# EAGLE design R601E (EAGLE 6.6.0)
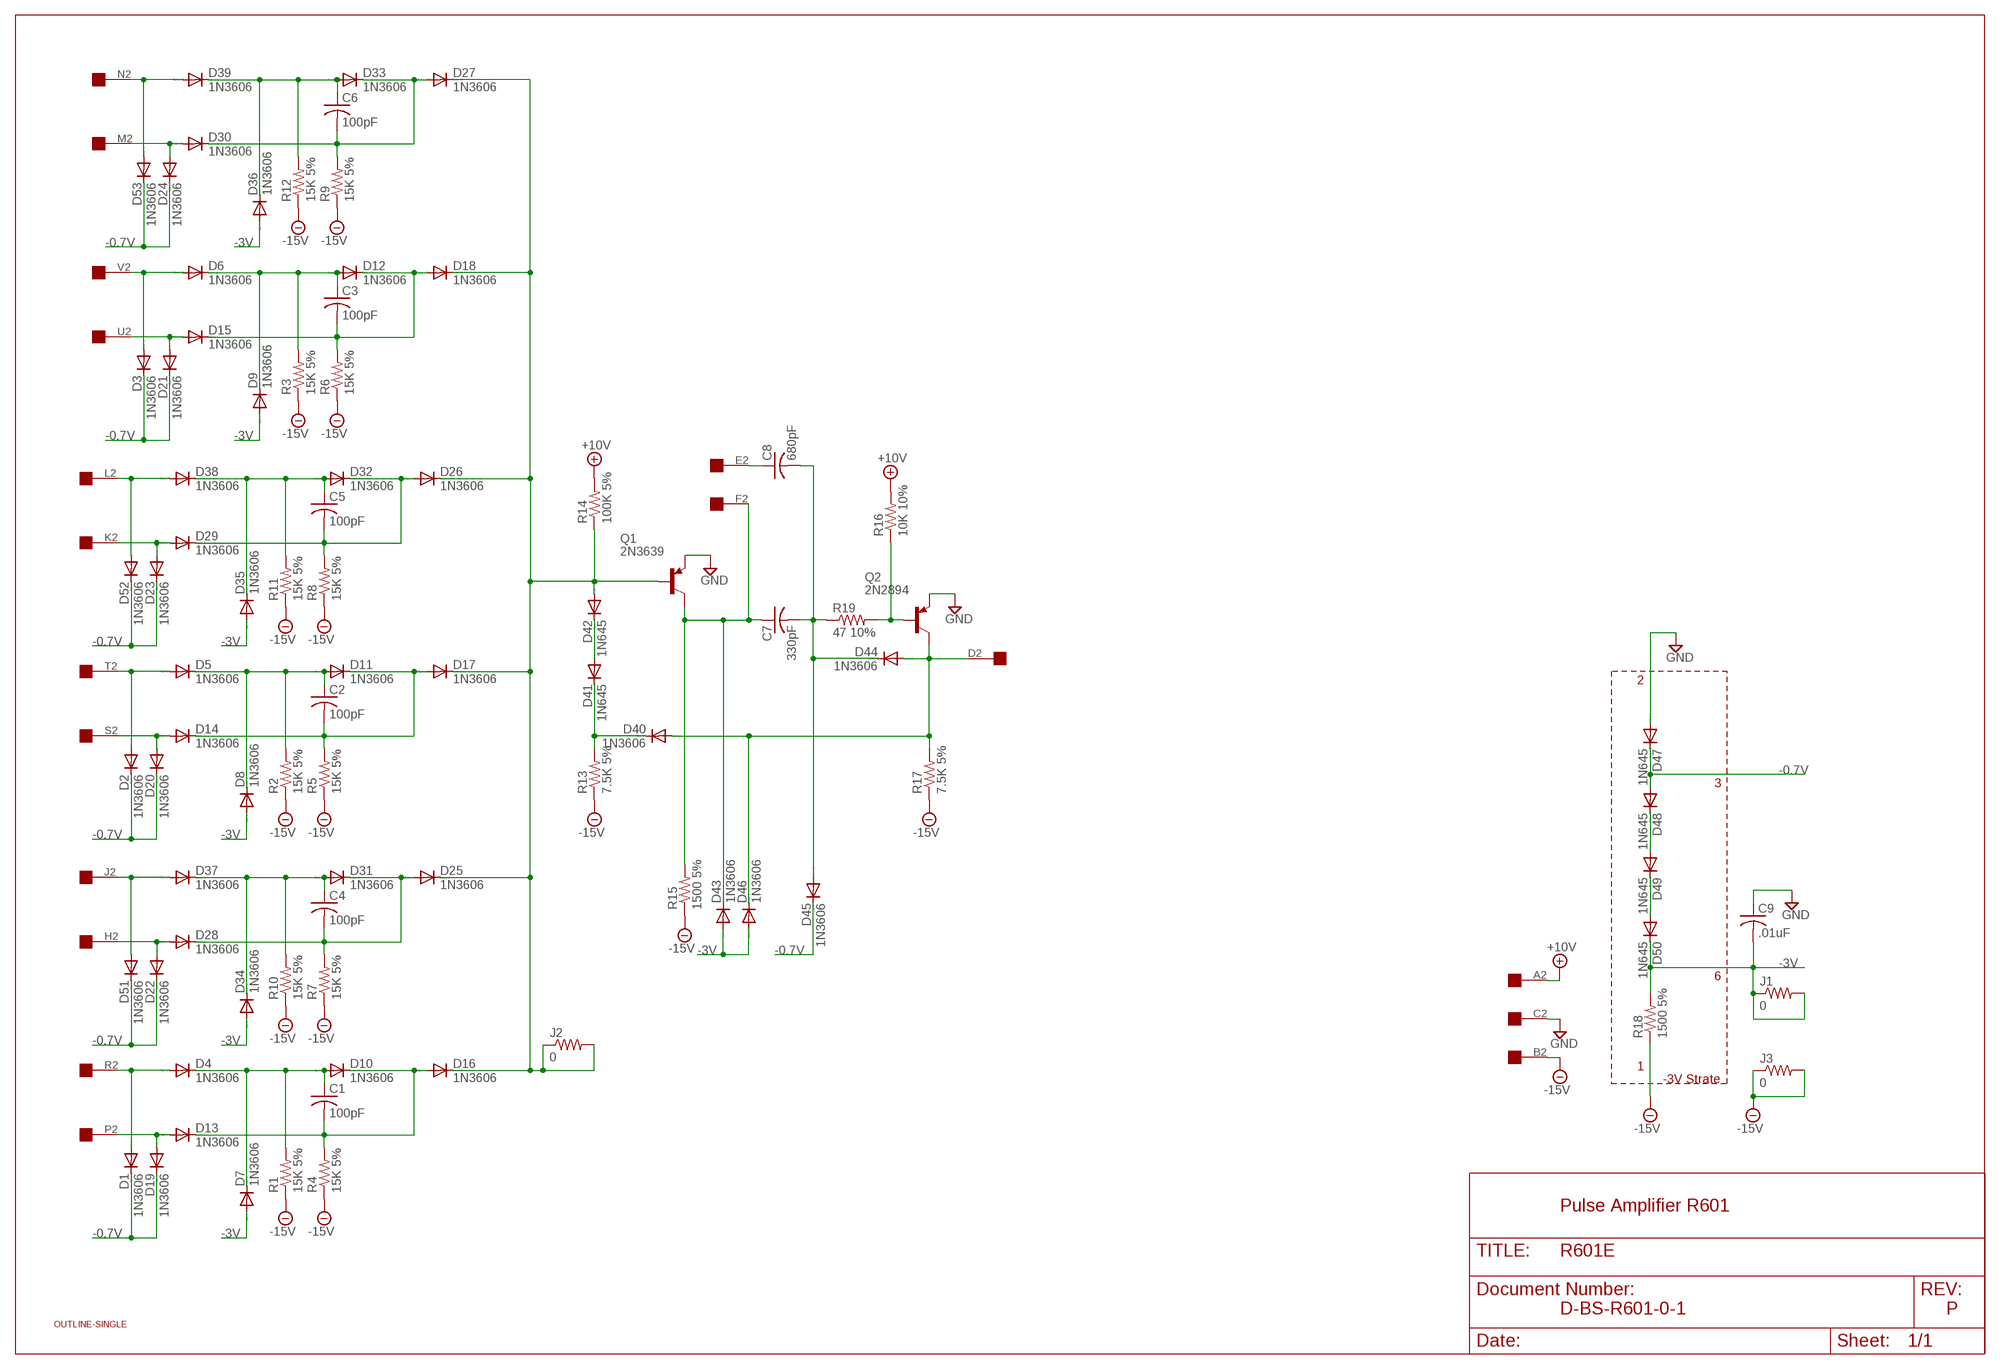
[diagram p0: schematic, sheet 1]

## Parts
C1  100pF  C-US  [C063-025X075]
C2  100pF  C-US  [C063-025X075]
C3  100pF  C-US  [C063-025X075]
C4  100pF  C-US  [C063-025X075]
C5  100pF  C-US  [C063-025X075]
C6  100pF  C-US  [C063-025X075]
C7  330pF  C-US  [C063-025X075]
C8  680pF  C-US  [C063-025X075]
C9  .01uF  C-US  [C063-025X075]
D1  1N3606  1N4148DO35-10  [DO35-10]
D2  1N3606  1N4148DO35-10  [DO35-10]
D3  1N3606  1N4148DO35-10  [DO35-10]
D4  1N3606  1N4148DO35-10  [DO35-10]
D5  1N3606  1N4148DO35-10  [DO35-10]
D6  1N3606  1N4148DO35-10  [DO35-10]
D7  1N3606  1N4148DO35-10  [DO35-10]
D8  1N3606  1N4148DO35-10  [DO35-10]
D9  1N3606  1N4148DO35-10  [DO35-10]
D10  1N3606  1N4148DO35-10  [DO35-10]
D11  1N3606  1N4148DO35-10  [DO35-10]
D12  1N3606  1N4148DO35-10  [DO35-10]
D13  1N3606  1N4148DO35-10  [DO35-10]
D14  1N3606  1N4148DO35-10  [DO35-10]
D15  1N3606  1N4148DO35-10  [DO35-10]
D16  1N3606  1N4148DO35-10  [DO35-10]
D17  1N3606  1N4148DO35-10  [DO35-10]
D18  1N3606  1N4148DO35-10  [DO35-10]
D19  1N3606  1N4148DO35-10  [DO35-10]
D20  1N3606  1N4148DO35-10  [DO35-10]
D21  1N3606  1N4148DO35-10  [DO35-10]
D22  1N3606  1N4148DO35-10  [DO35-10]
D23  1N3606  1N4148DO35-10  [DO35-10]
D24  1N3606  1N4148DO35-10  [DO35-10]
D25  1N3606  1N4148DO35-10  [DO35-10]
D26  1N3606  1N4148DO35-10  [DO35-10]
D27  1N3606  1N4148DO35-10  [DO35-10]
D28  1N3606  1N4148DO35-10  [DO35-10]
D29  1N3606  1N4148DO35-10  [DO35-10]
D30  1N3606  1N4148DO35-10  [DO35-10]
D31  1N3606  1N4148DO35-10  [DO35-10]
D32  1N3606  1N4148DO35-10  [DO35-10]
D33  1N3606  1N4148DO35-10  [DO35-10]
D34  1N3606  1N4148DO35-10  [DO35-10]
D35  1N3606  1N4148DO35-10  [DO35-10]
D36  1N3606  1N4148DO35-10  [DO35-10]
D37  1N3606  1N4148DO35-10  [DO35-10]
D38  1N3606  1N4148DO35-10  [DO35-10]
D39  1N3606  1N4148DO35-10  [DO35-10]
D40  1N3606  1N4148DO35-10  [DO35-10]
D41  1N645  1N4148DO35-10  [DO35-10]
D42  1N645  1N4148DO35-10  [DO35-10]
D43  1N3606  1N4148DO35-10  [DO35-10]
D44  1N3606  1N4148DO35-10  [DO35-10]
D45  1N3606  1N4148DO35-10  [DO35-10]
D46  1N3606  1N4148DO35-10  [DO35-10]
D47  1N645  1N4148DO35-10  [DO35-10]
D48  1N645  1N4148DO35-10  [DO35-10]
D49  1N645  1N4148DO35-10  [DO35-10]
D50  1N645  1N4148DO35-10  [DO35-10]
D51  1N3606  1N4148DO35-10  [DO35-10]
D52  1N3606  1N4148DO35-10  [DO35-10]
D53  1N3606  1N4148DO35-10  [DO35-10]
J1  0  R-US_0207/10  [0207/10]
J2  0  R-US_0207/10  [0207/10]
J3  0  R-US_0207/10  [0207/10]
Q1  2N3639  2N2904  [TO39]
Q2  2N2894  2N2904  [TO39]
R1  15K 5%  R-US_0207/10  [0207/10]
R2  15K 5%  R-US_0207/10  [0207/10]
R3  15K 5%  R-US_0207/10  [0207/10]
R4  15K 5%  R-US_0207/10  [0207/10]
R5  15K 5%  R-US_0207/10  [0207/10]
R6  15K 5%  R-US_0207/10  [0207/10]
R7  15K 5%  R-US_0207/10  [0207/10]
R8  15K 5%  R-US_0207/10  [0207/10]
R9  15K 5%  R-US_0207/10  [0207/10]
R10  15K 5%  R-US_0207/10  [0207/10]
R11  15K 5%  R-US_0207/10  [0207/10]
R12  15K 5%  R-US_0207/10  [0207/10]
R13  7.5K 5%  R-US_0207/10  [0207/10]
R14  100K 5%  R-US_0207/10  [0207/10]
R15  1500 5%  R-US_0207/10  [0207/10]
R16  10K 10%  R-US_0207/10  [0207/10]
R17  7.5K 5%  R-US_0207/10  [0207/10]
R18  1500 5%  R-US_0207/10  [0207/10]
R19  47 10%  R-US_0207/10  [0207/10]
U$1  OUTLINE-SINGLE  [SINGLE]
U$2  EDGE-1  [EDGE-CON1]

## Nets
+10V [Supply]: R14.2 R16.2 U$2.A2
-0.7V [Supply]: D1.C D2.C D3.C D19.C D20.C D21.C D22.C D23.C D24.C D45.C D47.C D48.A D51.C D52.C D53.C
-3V [Supply]: C9.2 D7.A D8.A D9.A D34.A D35.A D36.A D43.A D46.A D50.C J1.1 J1.2 R18.2
-15V [Supply]: J3.1 J3.2 R1.1 R2.1 R3.1 R4.1 R5.1 R6.1 R7.1 R8.1 R9.1 R10.1 R11.1 R12.1 R13.1 R15.1 R17.1 R18.1 U$2.B2
GND [Supply]: C9.1 D47.A Q1.1(E) Q2.1(E) U$2.C2
N$1: D37.A D51.A U$2.J2
N$2: D40.C D41.C R13.2
N$3: D39.A D53.A U$2.N2
N$4: D24.A D30.A U$2.M2
N$5: C6.1 D33.A D36.C D39.C R12.2
N$6: C6.2 D27.A D30.C D33.C R9.2
N$7: D41.A D42.C
N$8 [Supply]: D48.C D49.A
N$9 [Supply]: D49.C D50.A
N$10: D16.C D17.C D18.C D25.C D26.C D27.C D42.A J2.1 J2.2 Q1.2(B) R14.1
N$11: C7.1 D43.C Q1.3(C) R15.2 U$2.F2
N$12: C7.2 C8.2 D44.C D45.A R19.1
N$13: Q2.2(B) R16.1 R19.2
N$14: D40.A D44.A D46.C Q2.3(C) R17.2 U$2.D2
N$15: D3.A D6.A U$2.V2
N$16: D15.A D21.A U$2.U2
N$17: C3.1 D6.C D9.C D12.A R3.2
N$18: C3.2 D12.C D15.C D18.A R6.2
N$19: D38.A D52.A U$2.L2
N$20: D23.A D29.A U$2.K2
N$21: C5.1 D32.A D35.C D38.C R11.2
N$22: C5.2 D26.A D29.C D32.C R8.2
N$23: D22.A D28.A U$2.H2
N$24: C4.1 D31.A D34.C D37.C R10.2
N$25: C4.2 D25.A D28.C D31.C R7.2
N$26: D1.A D4.A U$2.R2
N$27: D13.A D19.A U$2.P2
N$28: C1.1 D4.C D7.C D10.A R1.2
N$29: C1.2 D10.C D13.C D16.A R4.2
N$30: C8.1 U$2.E2
N$31: D2.A D5.A U$2.T2
N$32: D14.A D20.A U$2.S2
N$33: C2.1 D5.C D8.C D11.A R2.2
N$34: C2.2 D11.C D14.C D17.A R5.2

## Notes on the sheet
- 2
- 3
- 6
- 1
- -3V Strate
- Pulse Amplifier R601
- D-BS-R601-0-1 | P

## Library data of the parts
C1-C9 = dec-con:C-US: Capacitors with funky DEC lead spacing.
D1-D53 = diode:1N4148: DIODE high speed (Philips)
J1-J3 R1-R19 = rcl:R-US_: RESISTOR, American symbol
Q1 Q2 = transistor-pnp:2N2904*: PNP Transistror
U$1 = dec-con:OUTLINE-*: Board outlines for DEC boards.
U$2 = dec-con:EDGE-1: Single-Sided DEC Edge Connector -- (side 2)

## Net classes
1 Supply: width 0.813 mm

## Board
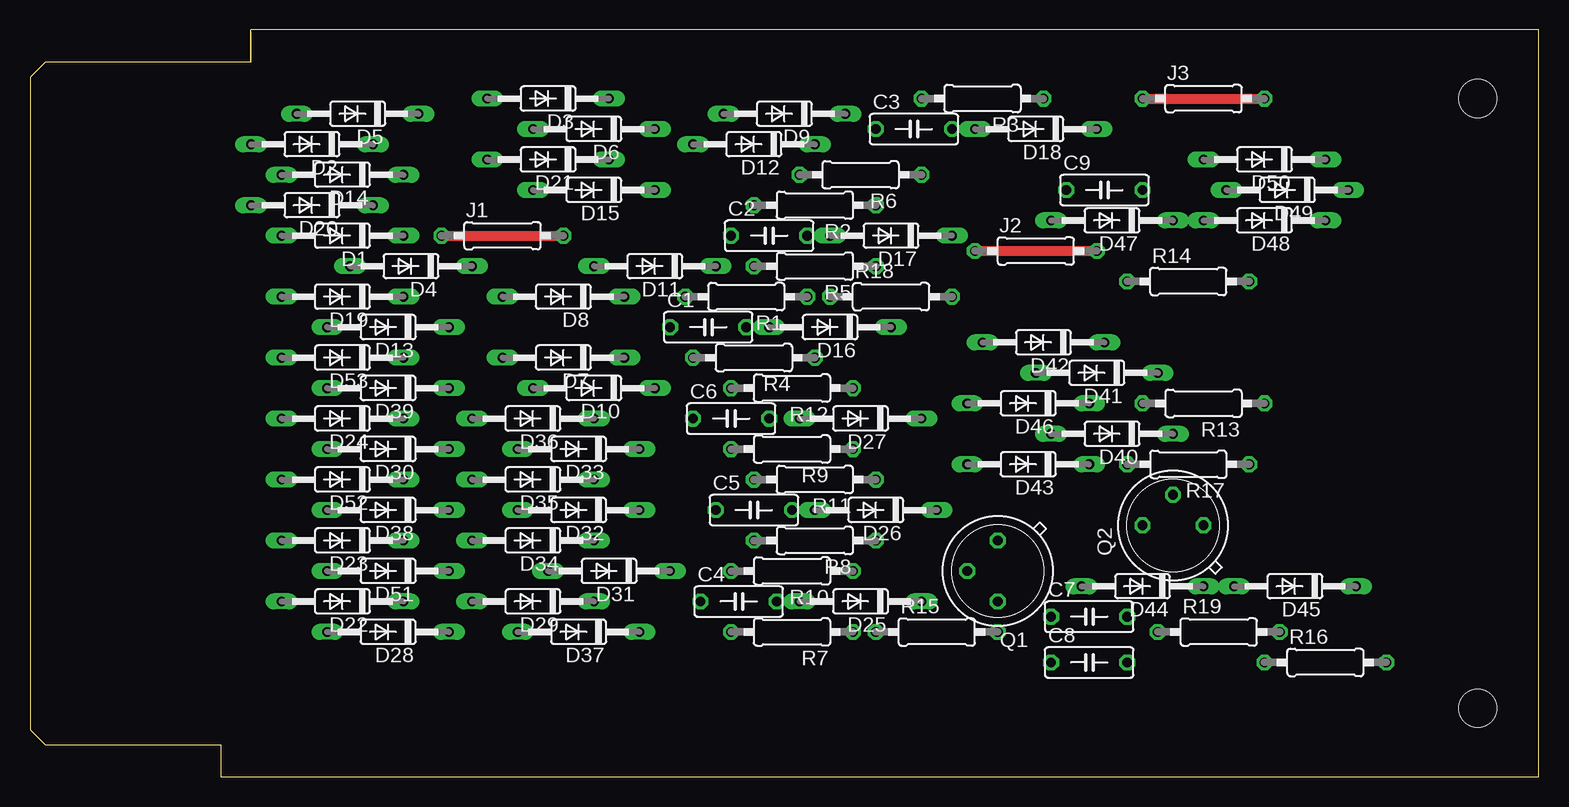
[diagram p1: board, top side]
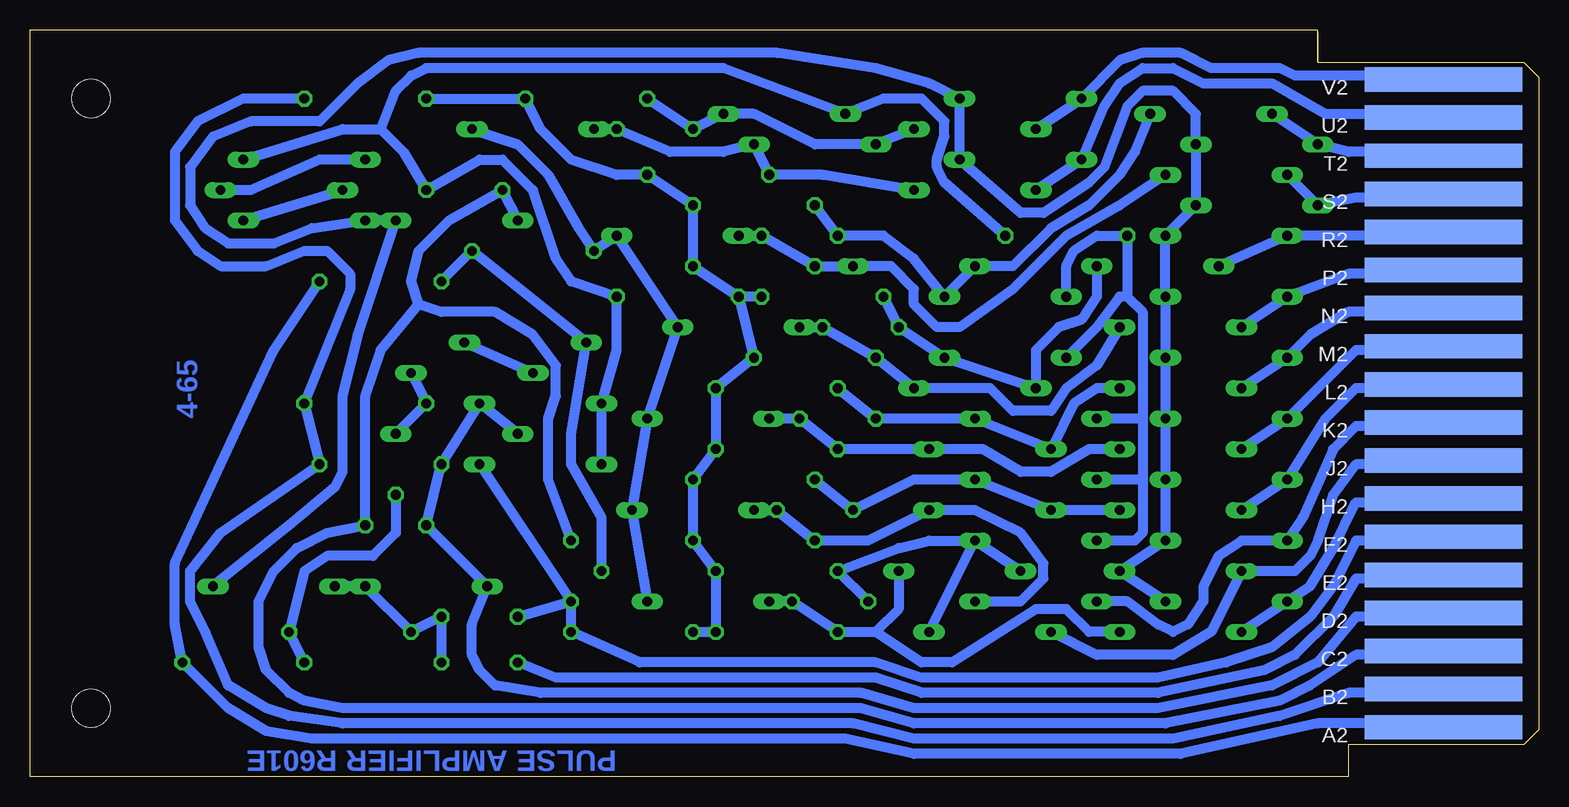
[diagram p2: board, bottom side, seen from below]

Size 125.73 x 62.23 mm. Coordinates in mm from the lower left corner, seen from the top.
Copper layers (1+16): Top 0.035mm / dielectric 1.5mm / Bottom 0.035mm
Design rules "16mils": minimum track width 16mil, minimum drill 32mil, track to track 15mil, track to pad 10mil, pad to pad 10mil, via to via 10mil, smd to smd 10mil, copper to edge 13mil, drill to drill 10mil, minimum pad ring 10mil, minimum via ring 8mil, stop-mask expansion 0mil, vias tented up to drill 0mil, thermal gap 10mil

### Footprints (pad centres in the part's own frame; a part is rotated, then mirrored left to right if it is on the bottom)
C063-025X075 = drill 0.813 octagon: 1 -2.54,0; 2 3.81,0
DO35-10 = drill 0.813 long: A 5.08,0; C -5.08,0
0207/10 = drill 0.813 octagon: 1 -5.08,0; 2 5.08,0
TO39 = drill 0.813 octagon: 1 0,-2.54; 2 2.54,0; 3 0,2.54
SINGLE = hole 3.175: 120.65,56.515; 120.65,5.715
EDGE-CON1 = smd 13.106 x 2.032 bottom: A2 7.938,4.128; B2 7.938,7.303; C2 7.938,10.477; D2 7.938,13.652; E2 7.938,16.828; F2 7.938,20.003; H2 7.938,23.177; J2 7.938,26.352; K2 7.938,29.527; L2 7.938,32.703; M2 7.938,35.877; N2 7.938,39.053; P2 7.938,42.227; R2 7.938,45.403; S2 7.938,48.578; T2 7.938,51.752; U2 7.938,54.928; V2 7.938,58.102

### Placement (x,y rotation side)
C1  55.88,37.47 0 top
C2  60.96,45.09 0 top
C3  73.03,53.98 0 top
C4  58.42,14.61 0 top
C5  59.69,22.23 0 top
C6  57.79,29.84 0 top
C7  87.63,13.34 0 top
C8  87.63,9.53 0 top
C9  88.9,48.9 0 top
D1  26.04,45.09 180 top
D2  23.5,52.7 180 top
D3  43.18,56.52 180 top
D4  31.75,42.55 180 top
D5  27.31,55.24 180 top
D6  46.99,53.98 180 top
D7  44.45,34.92 180 top
D8  44.45,40.01 180 top
D9  62.87,55.24 180 top
D10  46.99,32.38 180 top
D11  52.07,42.55 180 top
D12  60.33,52.7 180 top
D13  29.85,37.47 180 top
D14  26.04,50.16 180 top
D15  46.99,48.9 180 top
D16  66.68,37.47 180 top
D17  71.76,45.09 180 top
D18  83.82,53.98 180 top
D19  26.04,40.01 180 top
D20  23.5,47.62 180 top
D21  43.18,51.44 180 top
D22  26.04,14.61 180 top
D23  26.04,19.68 180 top
D24  26.04,29.84 180 top
D25  69.22,14.61 180 top
D26  70.49,22.23 180 top
D27  69.22,29.84 180 top
D28  29.85,12.06 180 top
D29  41.91,14.61 180 top
D30  29.85,27.3 180 top
D31  48.26,17.14 180 top
D32  45.72,22.23 180 top
D33  45.72,27.3 180 top
D34  41.91,19.68 180 top
D35  41.91,24.77 180 top
D36  41.91,29.84 180 top
D37  45.72,12.06 180 top
D38  29.85,22.23 180 top
D39  29.85,32.38 180 top
D40  90.17,28.57 180 top
D41  88.9,33.66 180 top
D42  84.46,36.2 180 top
D43  83.19,26.04 180 top
D44  92.71,15.88 180 top
D45  105.41,15.88 180 top
D46  83.19,31.11 180 top
D47  90.17,46.35 180 top
D48  102.87,46.35 180 top
D49  104.78,48.9 180 top
D50  102.87,51.44 180 top
D51  29.85,17.14 180 top
D52  26.04,24.77 180 top
D53  26.04,34.92 180 top
J1  39.37,45.09 0 top
J2  83.82,43.81 0 top
J3  97.79,56.52 0 top
Q1  80.65,17.14 180 top
Q2  95.25,20.95 90 top
R1  59.69,40.01 180 top
R2  65.41,47.62 180 top
R3  79.38,56.52 180 top
R4  60.33,34.92 180 top
R5  65.41,42.55 180 top
R6  69.22,50.16 180 top
R7  63.5,12.06 180 top
R8  65.41,19.68 180 top
R9  63.5,27.3 180 top
R10  63.5,17.14 180 top
R11  65.41,24.77 180 top
R12  63.5,32.38 180 top
R13  97.79,31.11 180 top
R14  96.52,41.27 0 top
R15  75.57,12.06 0 top
R16  107.95,9.53 0 top
R17  96.52,26.04 180 top
R18  71.76,40.01 0 top
R19  99.06,12.06 0 top
U$1  0,0 0 top
U$2  0,0 0 top

### Tracks (layer width: path | path; a pad name or v marks a point on that pad's centre or on a via)
+10V
  Bottom 0.813: U$2.A2 8.89,4.45 18.42,4.45 29.85,1.91 52.07,1.91 57.79,3.17 102.24,3.17 106.05,3.81 109.22,5.71 R16.2 113.67,12.7 113.67,17.78 105.41,35.56 R14.2
-0.7V
  Bottom 0.813: D22.C D51.C D23.C D52.C D24.C D53.C D19.C D1.C D20.C D2.C 28.58,55.24 30.48,57.15 33.02,57.15 34.29,55.88 36.2,50.8 37.47,49.53 41.28,46.99 43.18,46.99 D21.C D3.C 50.8,57.78 55.25,59.05 63.5,60.33 93.35,60.33 95.89,59.69 98.43,57.78 101.6,54.61 107.32,54.61 110.49,53.34 112.4,50.8 112.4,47.62 111.13,45.72 109.22,44.45 105.41,44.45 102.24,45.72 D48.A D47.C 98.43,36.83 99.7,31.75 99.7,25.4 100.33,24.13 104.14,20.95 D45.C
-3V
  Top 0.813: J1.1 J1.2
  Bottom 0.813: 34.29,40.01 J1.1 36.83,45.09 38.74,43.81 39.37,42.55 D8.A | 34.29,40.01 33.02,38.73 33.02,29.84 | 33.02,29.84 33.02,24.77 | 33.02,24.77 33.02,20.32 33.66,19.68 D34.A | 33.02,24.77 D35.A | 33.02,29.84 D36.A | 34.29,40.01 34.93,40.01 36.83,37.47 D7.A | J1.2 49.53,49.53 50.17,50.8 50.17,51.44 49.53,53.34 49.53,54.61 51.44,56.52 54.61,56.52 D9.A 67.95,59.05 92.71,59.05 93.98,58.42 95.25,57.15 96.52,53.98 | D50.C 99.7,53.98 96.52,53.98 | 96.52,53.98 94.62,52.07 C9.2 88.27,51.44 86.36,51.44 83.82,48.9 81.92,43.18 80.65,41.27 R18.2 76.84,35.56 D46.A D43.A
-15V
  Top 0.813: J3.1 J3.2
  Bottom 0.813: U$2.B2 8.26,6.99 15.88,6.99 21.59,5.08 30.48,3.17 52.07,3.17 57.15,4.45 99.7,4.45 104.14,5.08 106.05,5.71 109.22,7.62 111.13,12.06 112.4,14.61 112.4,17.14 109.86,20.32 R17.1 R13.1 99.06,40.64 99.06,41.91 100.97,43.81 102.87,43.81 106.05,42.55 109.86,42.55 111.76,43.81 113.67,46.35 113.67,52.07 111.76,54.61 107.95,56.52 J3.2 | R1.1 R18.1 | R18.1 R5.1 R2.1 R6.1 76.84,50.16 80.65,51.44 83.19,53.98 R3.1 J3.1 | R18.1 R4.1 R12.1 R9.1 R11.1 R8.1 R10.1 R7.1 R15.1
GND
  Bottom 0.813: U$2.C2 8.89,10.16 15.24,10.16 19.05,7.62 21.59,6.35 31.12,4.45 52.07,4.45 56.52,5.71 99.7,5.71 102.87,6.35 104.14,6.99 106.05,8.89 106.68,10.79 106.68,14.61 105.41,17.14 103.51,19.05 100.97,20.32 Q2.1 97.79,31.75 96.52,35.56 93.35,39.37 | 93.35,39.37 93.98,41.27 93.35,43.81 90.81,46.35 C9.1 D47.A | Q1.1 82.55,24.77 82.55,29.84 81.92,31.75 81.92,34.29 83.82,36.83 87,38.73 91.44,38.73 93.35,39.37
N$1
  Bottom 0.813: U$2.J2 8.89,26.04 15.24,26.04 17.15,23.5 18.42,19.68 19.05,18.41 20.32,17.14 D51.A 27.31,12.06 30.48,10.16 36.83,10.16 D37.A
N$2
  Bottom 0.813: D40.C R13.2 D41.C
N$3
  Bottom 0.813: D39.A D53.A 19.05,36.83 15.88,38.73 8.89,38.73 U$2.N2
N$4
  Bottom 0.813: U$2.M2 8.89,35.56 15.24,35.56 D24.A D30.A
N$5
  Bottom 0.813: D39.C 36.83,32.38 38.74,31.11 D33.A D36.C C6.1 R12.2
N$6
  Bottom 0.813: D30.C 37.47,27.3 40.64,25.4 43.18,25.4 46.36,27.3 D33.C R9.2 C6.2 D27.A
N$7
  Bottom 0.813: D42.C D41.A
N$8
  Bottom 0.813: D48.C D49.A
N$9
  Bottom 0.813: D50.A 101.6,51.44 107.32,48.9 D49.C
N$10
  Top 0.813: J2.1 J2.2
  Bottom 0.813: D25.C D26.C D27.C D16.C D17.C J2.1 80.01,45.72 82.55,50.16 85.09,52.7 D18.C | R14.1 J2.2 D42.A 80.65,28.57 80.65,26.04 78.11,21.59 Q1.2
N$11
  Bottom 0.813: U$2.F2 8.89,19.68 15.24,19.68 17.15,15.88 19.05,13.34 22.23,10.79 26.04,9.53 31.75,8.26 51.44,8.26 55.25,9.53 74.93,9.53 R15.2 Q1.3 | C7.1 Q1.3 | D43.C Q1.3
N$12
  Bottom 0.813: C8.2 C7.2 R19.1 D44.C D45.A
N$13
  Bottom 0.813: R16.1 R19.2 102.87,17.14 100.97,18.41 97.16,18.41 95.25,20.32 Q2.2
N$14
  Bottom 0.813: U$2.D2 8.89,13.34 15.24,13.34 18.42,9.53 22.23,7.62 31.75,5.71 52.07,5.71 56.52,6.99 83.19,6.99 87,7.62 88.27,8.89 88.9,10.16 88.9,12.7 D44.A Q2.3 R17.2 D46.C D40.A
N$15
  Bottom 0.813: U$2.V2 8.26,58.42 20.32,58.42 21.59,59.05 27.31,59.05 29.85,60.33 33.02,60.33 34.93,59.69 D3.A D6.A
N$16
  Bottom 0.813: D15.A D21.A 36.2,55.88 34.93,57.78 33.02,59.05 30.48,59.05 27.94,57.78 22.23,57.78 17.78,55.24 8.89,55.24 U$2.U2
N$17
  Bottom 0.813: D6.C D12.A 60.33,52.7 65.41,55.24 D9.C C3.1 R3.2
N$18
  Bottom 0.813: D15.C 59.69,50.16 R6.2 D12.C 67.95,52.07 72.39,52.07 C3.2 D18.A
N$19
  Bottom 0.813: U$2.L2 8.26,32.38 15.24,32.38 17.78,29.84 D52.A D38.A
N$20
  Bottom 0.813: U$2.K2 8.89,29.21 15.24,29.21 17.15,27.3 19.69,21.59 D23.A 24.77,19.68 26.67,18.41 27.94,15.88 27.94,14.61 29.21,12.7 30.48,12.06 31.75,12.7 34.29,14.61 D29.A
N$21
  Bottom 0.813: D38.C D32.A D35.C 52.07,24.77 C5.1 R11.2
N$22
  Bottom 0.813: D29.C 43.18,14.61 41.28,16.51 41.28,17.78 43.18,20.32 46.99,22.23 D32.C 55.88,19.68 R8.2 C5.2 D26.A
N$23
  Bottom 0.813: D28.A D22.A 19.05,15.88 17.15,19.05 15.24,22.86 8.26,22.86 U$2.H2
N$24
  Bottom 0.813: D37.C D34.C | D34.C D31.A | C4.1 R10.2 53.34,19.05 50.8,19.68 D34.C
N$25
  Bottom 0.813: D28.C 37.47,12.06 39.37,13.97 41.91,13.97 48.9,9.53 51.44,9.53 55.25,12.06 | 55.25,12.06 R7.2 C4.2 D25.A | D31.C 53.34,13.97 55.25,12.06
N$26
  Bottom 0.813: U$2.R2 8.89,45.09 D1.A D4.A
N$27
  Bottom 0.813: D13.A D19.A 15.88,41.91 9.53,41.91 U$2.P2
N$28
  Bottom 0.813: D4.C 36.83,40.01 38.1,38.1 40.01,37.47 41.91,35.56 D10.A D7.C C1.1 R1.2
N$29
  Bottom 0.813: D13.C 36.83,34.29 39.37,32.38 40.64,30.48 43.82,30.48 45.72,32.38 D10.C R4.2 C1.2 D16.A
N$30
  Bottom 0.813: U$2.E2 8.26,16.51 15.24,16.51 17.15,13.34 20.32,10.16 22.86,8.89 31.75,6.99 51.44,6.99 55.25,8.26 81.92,8.26 C8.1
N$31
  Bottom 0.813: U$2.T2 8.89,52.07 15.88,52.07 D2.A D5.A
N$32
  Bottom 0.813: U$2.S2 8.26,48.26 15.24,48.26 D20.A D14.A
N$33
  Bottom 0.813: D5.C 33.66,52.07 34.93,50.16 37.47,47.62 40.64,45.72 43.82,42.55 D11.A D8.C 52.07,43.18 54.61,45.09 C2.1 R2.2
N$34
  Bottom 0.813: D14.C 34.93,47.62 39.37,45.09 43.82,40.64 48.26,37.47 50.17,37.47 52.07,39.37 52.07,40.64 53.98,42.55 D11.C R5.2 C2.2 D17.A

### Text on the board
Bottom: 4-65 | PULSE AMPLIFIER R601E